# EasyEDA Pro project TC358870 HDMI2MIPI.epro, board PCB11
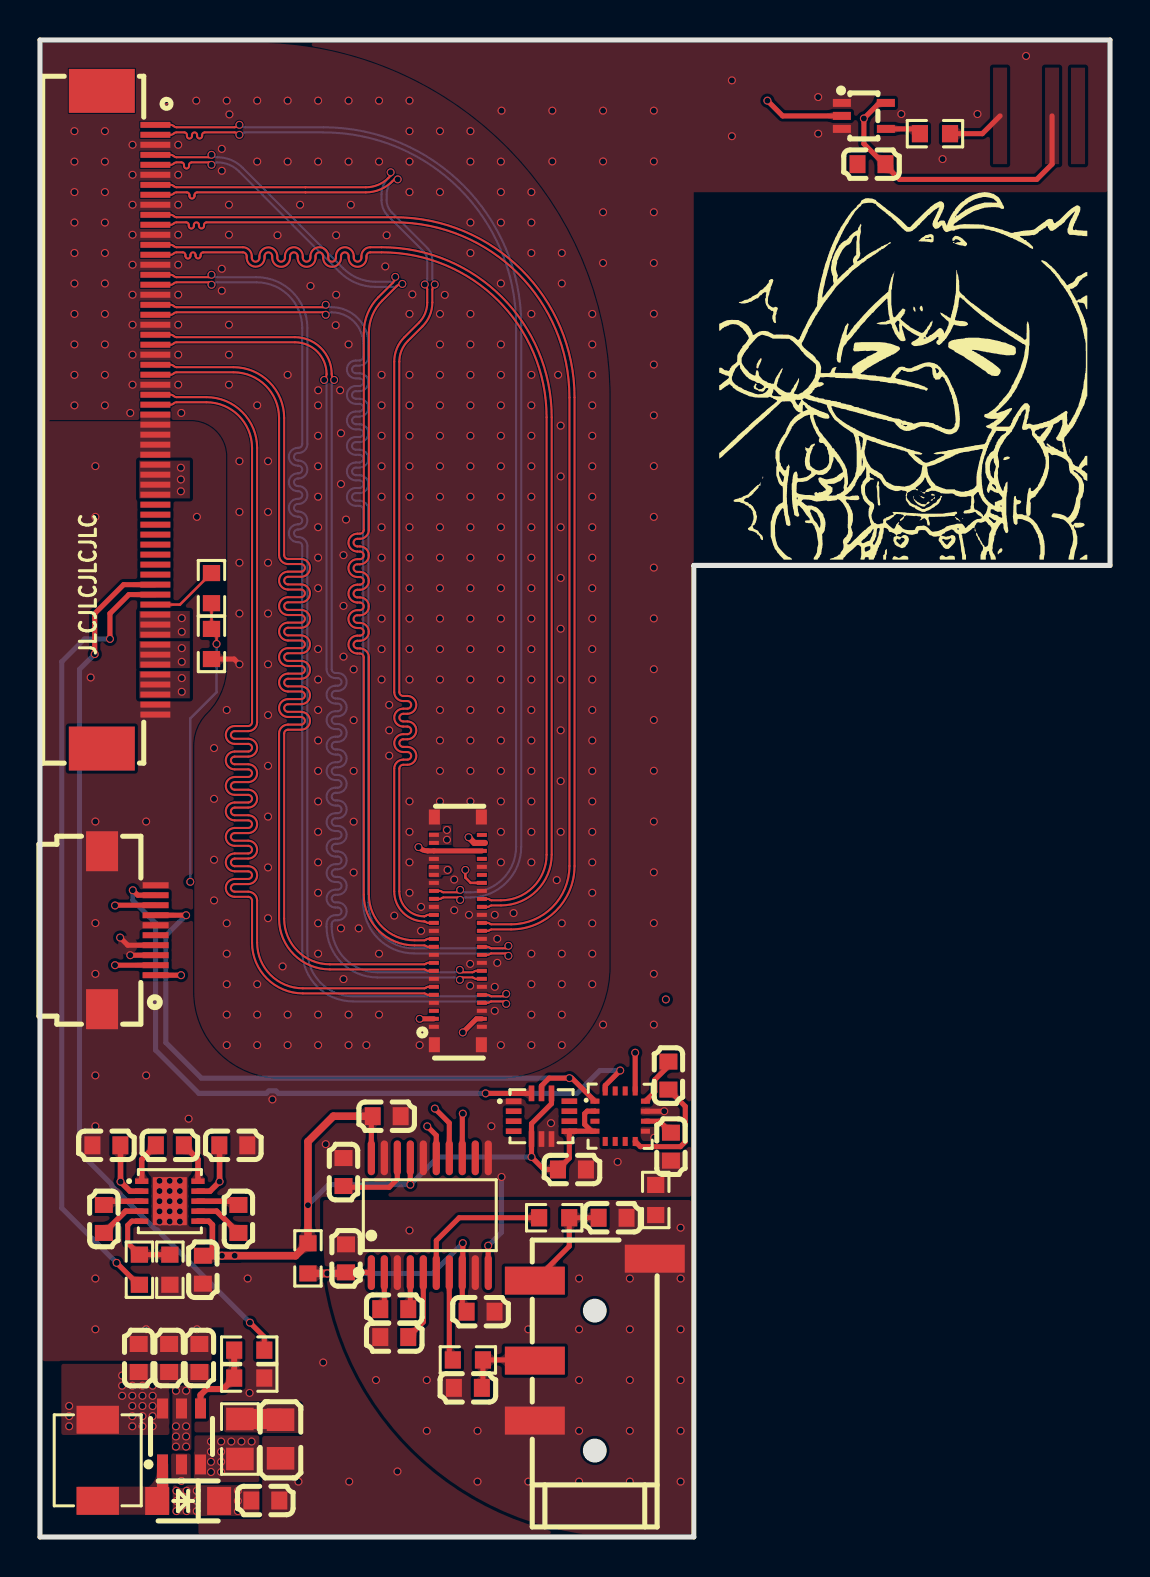
[diagram p12: board, top side]
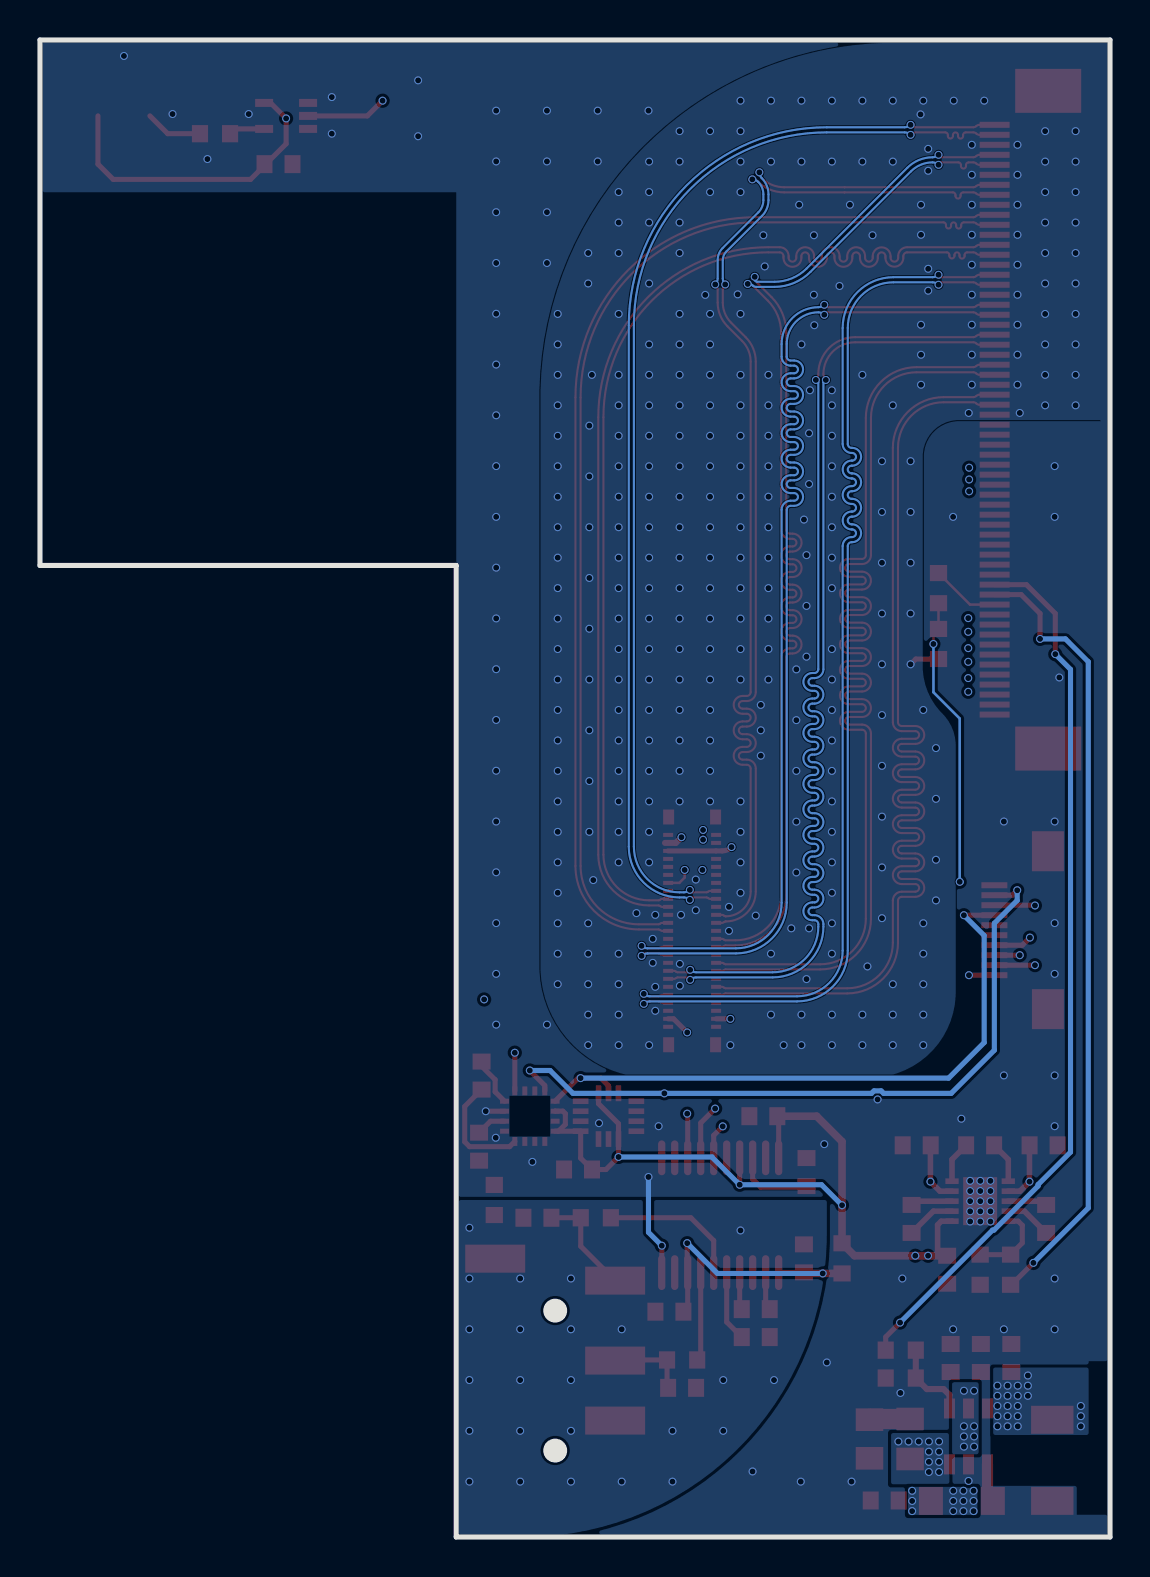
[diagram p13: board, bottom side, seen from below]

Outline 53.53 x 74.89 mm; copper layers: Top Layer, Inner1, Inner2, Bottom Layer. Coordinates in mm from the lower left corner of the outline.
Outline path: 0,74.89 0,0 32.71,0 32.71,48.6 53.53,48.6 53.53,74.89 0,74.89
Stack: Top Layer 0.035mm 外层铜厚1oz / Dielectric1 0.2104mm 7628 RC49% 8.6mil / Inner1 0.0152mm 内层铜厚 / Dielectric2 1.065mm 1.1mm H/HOZ Copper / Inner2 0.0152mm 内层铜厚 / Dielectric3 0.2104mm 7628 RC49% 8.6mil / Bottom Layer 0.035mm 外层铜厚1oz

## Design rules (mm)
net MIPI0_D0N: MIPI0_D0
net MIPI0_D0P: MIPI0_D0
net MIPI0_D1N: MIPI0_D1
net MIPI0_D1P: MIPI0_D1
net MIPI0_CN: MIPI0_C
net MIPI0_CP: MIPI0_C
net MIPI0_D2N: MIPI0_D2
net MIPI0_D2P: MIPI0_D2
net MIPI0_D3N: MIPI0_D3
net MIPI0_D3P: MIPI0_D3
net MIPI1_D0N: MIPI1_D0
net MIPI1_D0P: MIPI1_D0
net MIPI1_D1N: MIPI1_D1
net MIPI1_D1P: MIPI1_D1
net MIPI1_CN: MIPI1_C
net MIPI1_CP: MIPI1_C
net MIPI1_D2N: MIPI1_D2
net MIPI1_D2P: MIPI1_D2
net MIPI1_D3N: MIPI1_D3
net MIPI1_D3P: MIPI1_D3
template: 自定义配置
spacing copperThickness1oz (default): track to track 0.102, other pairs 0.102 to 0.3
spacing copperThickness2oz: track to track 0.203, other pairs 0.152 to 0.3
spacing copperThicknessInner0.5oz: track to track 0.089, other pairs 0.152 to 0.3
track width copperThickness1oz (default): min 0.102, default 0.254, max 2.54
track width copperThickness2oz: min 0.203, default 0.254, max 2.54
track width copperThickness0.5oz: min 0.089, default 0.254, max 2.54
differential pair differentialPair: width min 0.127, default 0.127, max 2.54; gap min 0.127, default 0.127
differential pair 5mil (default): width min 0.104, default 0.104, max 2.54; gap min 0.152, default 0.152
via viaSize (default): diameter min 0.399, default 0.399, max 10; hole min 0.3, default 0.3, max 6.299
net MIPI0_D0N uses diff
net MIPI0_D0P uses diff
net MIPI0_D1N uses diff
net MIPI0_D1P uses diff
net MIPI0_CN uses diff
net MIPI0_CP uses diff
net MIPI0_D2N uses diff
net MIPI0_D2P uses diff
net MIPI0_D3N uses diff
net MIPI0_D3P uses diff
net MIPI1_D0N uses diff
net MIPI1_D0P uses diff
net MIPI1_D1N uses diff
net MIPI1_D1P uses diff
net MIPI1_CN uses diff
net MIPI1_CP uses diff
net MIPI1_D2N uses diff
net MIPI1_D2P uses diff
net MIPI1_D3N uses diff
net MIPI1_D3P uses diff
eq len grp MIPI uses diff

## Placement (name value [footprint] x y rotation side)
C1  10uF  [C0603]  4.94 8.96 270 top
C2  10uF  [C0603]  6.46 8.96 270 top
C3  100nF  [C0603]  7.97 8.96 270 top
C4  2.2uF  [C0603]  11.27 1.83 180 top
C5  100nF  [C0603]  17.34 21.05 180 top
C6  100nF  [C0603]  15.31 13.94 270 top
C7  100nF  [C0603]  15.19 18.26 90 top
C8  2.2uF  [C0603]  17.72 11.4 0 top
C9  2.2nF  [C0603]  28.65 15.97 0 top
C10  2.2uF  [C0603]  17.72 10 180 top
C11  2.2nF  [C0603]  21.41 7.46 0 top
C12  100nF  [C0603]  22.04 11.27 0 top
C13  10uF  [C0603]  8.15 13.37 90 top
C14  2.2uF  [C0603]  3.2 15.91 90 top
C15  10uF  [C0603]  9.67 19.59 180 top
C16  2.2uF  [C0603]  9.93 15.91 90 top
C17  10uF  [C0603]  3.32 19.59 0 top
C18  2.2uF  [C0603]  6.5 19.59 180 top
C19  220nF  [C0603]  31.44 23.08 90 top
C20  4.7uF  [C0603]  31.57 19.53 270 top
C21  100nF  [C0603]  41.6 68.68 180 top
CN1  PJ-320D  [AUDIO-SMD_PJ-320D]  27.76 9.87 180 top
D1  SS36FA  [SOD-123FL_L2.8-W1.8-LS3.6-RD]  7.41 1.8 180 top
FPC1  AFC01-S60FCA-00  [FPC-SMD_AFC01-S60FCC-00]  4.43 55.89 270 top
FPC2  AFC01-S10FCA-00  [FPC-SMD_P0.5-10P_FGS-XJ-H2.0]  4.45 30.35 90 top
L1  4.7uH  [IND-SMD_L4.4-W4.2]  2.89 3.84 270 top
L2  CBG201209U121T  [L0805]  12.03 4.9 90 top
R1  10kΩ  [R0603]  8.58 47.47 270 top
R2  12kΩ  [R0603]  8.58 44.67 90 top
R3  5.9Ω  [R0805]  10 4.9 270 top
R4  0Ω  [R0603]  30.81 16.86 90 top
R5  10kΩ  [R0603]  10.47 9.35 180 top
R6  0Ω  [R0603]  13.41 13.94 90 top
R7  100kΩ  [R0603]  10.47 7.95 0 top
R8  470Ω  [R0603]  25.73 15.97 180 top
R9  470Ω  [R0603]  21.41 8.86 180 top
R10  10kΩ  [R0603]  4.97 13.37 90 top
R11  100kΩ  [R0603]  6.5 13.37 270 top
R12  470Ω  [R0603]  44.78 70.2 0 top
U1  RT9293BGJ6  [SOT-23-6_L2.9-W1.6-P0.95-LS2.8-BR]  7.08 5.03 270 top
U2  WP7B-S050VA1-R8000  [CONN-SMD_WP7B-S050VA1-R8000]  20.91 30.32 90 top
U3  PCM5102APWR  [TSSOP-20_L6.5-W4.4-P0.65-LS6.4-BL]  19.5 16.1 0 top
U4  LP3102QVF  [TDFN-10_L3.0-W3.0-P0.50-BL-EP]  6.5 16.8 270 top
U5  BMI160  [LGA-14_L3.0-W2.5-P0.50-BL]  25.09 21.05 270 top
U6  QMC5883L  [LGA-16_L3.0-W3.0-P0.50-BL_SQ]  29.03 21.05 270 top
U7  100nF  [C0603]  26.62 18.38 180 top
U9  SN74LV1T34DCKR  [SC-70-5_L2.1-W1.3-P0.65-LS2.1-BR]  41.22 71.09 180 top

## Footprints (pads in the part's own frame, mm; a bottom-side part is the same pattern mirrored in y, then rotated)
AUDIO-SMD_PJ-320D
  rect 3x1.4 smd: 1(-3,-4.05) 2(3,4.05) 3(3,1.05) 4(3,-2.95)
C0603
  rect 0.8x0.9 smd: 1(-0.7,0) 2(0.7,0)
CONN-SMD_WP7B-S050VA1-R8000
  rect 0.2x0.5 smd: 1(-4.8,1.2) 2(-4.8,-1.2) 3(-4.4,1.2) 4(-4.4,-1.2) 5(-4,1.2) 6(-4,-1.2) 7(-3.6,1.2) 8(-3.6,-1.2) 9(-3.2,1.2) 10(-3.2,-1.2) 11(-2.8,1.2) 12(-2.8,-1.2) 13(-2.4,1.2) 14(-2.4,-1.2) 15(-2,1.2) 16(-2,-1.2) 17(-1.6,1.2) 18(-1.6,-1.2) 19(-1.2,1.2) 20(-1.2,-1.2) 21(-0.8,1.2) 22(-0.8,-1.2) 23(-0.4,1.2) 24(-0.4,-1.2) 25(0,1.2) 26(0,-1.2) 27(0.4,1.2) 28(0.4,-1.2) 29(0.8,1.2) 30(0.8,-1.2) 31(1.2,1.2) 32(1.2,-1.2) 33(1.6,1.2) 34(1.6,-1.2) 35(2,1.2) 36(2,-1.2) 37(2.4,1.2) 38(2.4,-1.2) 39(2.8,1.2) 40(2.8,-1.2) 41(3.2,1.2) 42(3.2,-1.2) 43(3.6,1.2) 44(3.6,-1.2) 45(4,1.2) 46(4,-1.2) 47(4.4,1.2) 48(4.4,-1.2) 49(4.8,1.2) 50(4.8,-1.2)
  rect 0.75x0.55 smd: 51(-5.696,1.175) 52(5.696,1.175) 53(-5.696,-1.175) 54(5.696,-1.175)
FPC-SMD_AFC01-S60FCC-00
  rect 0.3x1.5 smd: 1(-14.75,1.34) 2(-14.251,1.34) 3(-13.751,1.34) 4(-13.25,1.34) 5(-12.75,1.34) 6(-12.249,1.34) 7(-11.749,1.34) 8(-11.25,1.34) 9(-10.751,1.34) 10(-10.251,1.34) 11(-9.75,1.34) 12(-9.249,1.34) 13(-8.749,1.34) 14(-8.25,1.34) 15(-7.75,1.34) 16(-7.25,1.34) 17(-6.75,1.34) 18(-6.25,1.34) 19(-5.75,1.34) 20(-5.249,1.34) 21(-4.749,1.34) 22(-4.251,1.34) 23(-3.751,1.34) 24(-3.25,1.34) 25(-2.75,1.34) 26(-2.249,1.34) 27(-1.749,1.34) 28(-1.25,1.34) 29(-0.751,1.34) 30(-0.251,1.34) 31(0.25,1.34) 32(0.75,1.34) 33(1.25,1.337) 34(1.751,1.337) 35(2.252,1.337) 36(2.749,1.34) 37(3.249,1.34) 38(3.75,1.34) 39(4.25,1.34) 40(4.751,1.34) 41(5.251,1.34) 42(5.749,1.34) 43(6.25,1.34) 44(6.75,1.34) 45(7.25,1.34) 46(7.75,1.34) 47(8.251,1.34) 48(8.75,1.34) 49(9.249,1.34) 50(9.749,1.34) 51(10.25,1.34) 52(10.751,1.34) 53(11.251,1.34) 54(11.751,1.34) 55(12.25,1.34) 56(12.749,1.34) 57(13.249,1.34) 58(13.75,1.34) 59(14.251,1.34) 60(14.751,1.34)
  rect 2.2x3.3 smd: 61(-16.45,-1.34) 62(16.45,-1.34)
FPC-SMD_P0.5-10P_FGS-XJ-H2.0
  rect 0.3x1.3 smd: 1(-2.25,-1.339) 2(-1.75,-1.339) 3(-1.25,-1.34) 4(-0.75,-1.339) 5(-0.25,-1.34) 6(0.25,-1.339) 7(0.75,-1.339) 8(1.25,-1.339) 9(1.75,-1.339) 10(2.25,-1.34)
  rect 2x1.6 smd: 11(3.95,1.34) 12(-3.95,1.34)
IND-SMD_L4.4-W4.2
  rect 1.4x2.12 smd: 1(2.028,0) 2(-2.028,0)
L0805
  rect 1.133x1.377 smd: 1(-0.967,0) 2(0.966,0)
LGA-14_L3.0-W2.5-P0.50-BL
  rect 0.28x0.785 smd: 1(-0.75,-1.393) 2(-0.25,-1.393) 3(0.25,-1.393) 4(0.75,-1.393) 8(0.75,1.393) 9(0.25,1.393) 10(-0.25,1.393) 11(-0.75,1.393)
  rect 0.785x0.28 smd: 5(1.143,-0.5) 6(1.143,0) 7(1.143,0.5) 12(-1.143,0.5) 13(-1.143,0) 14(-1.143,-0.5)
LGA-16_L3.0-W3.0-P0.50-BL_SQ
  rect 0.25x0.45 smd: 1(-0.75,-1.263) 2(-0.25,-1.263) 3(0.25,-1.263) 4(0.75,-1.263) 9(0.75,1.263) 10(0.25,1.263) 11(-0.25,1.263) 12(-0.75,1.263)
  rect 0.45x0.25 smd: 5(1.263,-0.75) 6(1.263,-0.25) 7(1.263,0.25) 8(1.263,0.75) 13(-1.263,0.75) 14(-1.263,0.25) 15(-1.263,-0.25) 16(-1.263,-0.75)
R0603
  rect 0.806x0.864 smd: 1(-0.753,0) 2(0.753,0)
R0805
  rect 1.133x1.377 smd: 1(-1,0) 2(1,0)
SC-70-5_L2.1-W1.3-P0.65-LS2.1-BR
  rect 0.9x0.4 smd: 1(1.1,-0.65) 2(1.1,0) 3(1.1,0.65) 4(-1.1,0.65) 5(-1.1,-0.65)
SOD-123FL_L2.8-W1.8-LS3.6-RD
  rect 1.2x1.4 smd: 1(-1.55,0) 2(1.55,0)
SOT-23-6_L2.9-W1.6-P0.95-LS2.8-BR
  rect 1x0.55 smd: 1(1.4,-0.95) 2(1.4,0) 3(1.4,0.95) 4(-1.4,0.95) 5(-1.4,0) 6(-1.4,-0.95)
TDFN-10_L3.0-W3.0-P0.50-BL-EP
  rect 0.28x0.665 smd: 1(-1,-1.407) 2(-0.5,-1.407) 3(0,-1.407) 4(0.5,-1.407) 5(1,-1.407) 6(1,1.407) 7(0.5,1.407) 8(0,1.407) 9(-0.5,1.407) 10(-1,1.407)
  rect 2.4x1.7 smd: 11(0,0)
TSSOP-20_L6.5-W4.4-P0.65-LS6.4-BL
  oval 0.364x1.742 smd: 1(-2.925,-2.871) 2(-2.275,-2.871) 3(-1.625,-2.871) 4(-0.975,-2.871) 5(-0.325,-2.871) 6(0.325,-2.871) 7(0.975,-2.871) 8(1.625,-2.871) 9(2.275,-2.871) 10(2.925,-2.871) 11(2.925,2.871) 12(2.275,2.871) 13(1.625,2.871) 14(0.975,2.871) 15(0.325,2.871) 16(-0.325,2.871) 17(-0.975,2.871) 18(-1.625,2.871) 19(-2.275,2.871) 20(-2.925,2.871)

## Nets
As in the schematic.

Pads without a net: C21 2; FPC1 61 62; R12 2; U2 5 40 44 50; U3 12; U5 2 3 4 9 10 11; U6 3 5 6 7 14 15

## Via types
v1: diameter 0.4, hole 0.3, Top Layer to Bottom Layer, 71 vias
v2: diameter 0.399, hole 0.299, Top Layer to Bottom Layer, 487 vias

## Routing (per net, layer and track width the routed paths; a pad name or vN(x,y) marks a point on that pad's centre or on a via; arc(x,y) is an arc through that point)
AGND:
  vias: v2(16.81,7.85) v2(18.49,15.34) v2(19.35,7.85) v2(19.35,5.31) v2(21.89,5.31) v2(21.89,2.77) v2(24.43,10.39) v2(24.43,2.77) v2(26.97,12.93) v2(26.97,10.39) v2(26.97,7.85) v2(26.97,5.31) v2(26.97,2.77) v2(29.51,12.93) v2(29.51,10.39) v2(29.51,7.85) v2(29.51,5.31) v2(29.51,2.77) v2(32.05,15.47) v2(32.05,12.93) v2(32.05,10.39) v2(32.05,7.85) v2(32.05,5.31) v2(32.05,2.77)
AVCC: length 14.1
  Top Layer w0.254: U3.1 16.57,13.24 C6.2 ; v2(21.15,14.7) 21.15,13.25 U3.8 21.13,11.36 21.22,11.27
  Top Layer w0.381: R6.1 v2(14.37,13.19) 15.26,13.19 C6.2
  Bottom Layer w0.254: v2(14.37,13.19) 19.64,13.19 v2(21.15,14.7)
AVDD_P+: length 19.6
  Top Layer w0.254: v2(21.15,25.24) 21.83,25.92 U2.4
  Top Layer w0.28: U4.9 8.51,17.3 v2(8.99,17.78) 8.99,19.58 C15.2
  Inner2 w0.508: v2(8.99,17.78) 13.69,17.78 v2(21.15,25.24)
AVDD_P-: length 22.1
  Top Layer w0.254: U2.3 v2(19,25.92)
  Top Layer w0.28: U4.2 4.51,17.3 v2(4.03,17.78) 4.03,19.59 C17.2
  Inner2 w0.508: v2(4.03,17.78) 6.41,20.16 13.24,20.16 v2(19,25.92)
GND: length 6
  Top Layer w0.254: U6.11 v2(31.23,21.3) ; 22.43,13.23 22.42,13.23 v2(22.42,14.57)
  Bottom Layer w0.254: v2(22.42,14.57) 23.09,15.24 v2(23.09,18.01)
  vias: v1(5.98,17.82) v1(5.98,17.31) v1(5.98,16.8) v1(5.98,16.29) v1(5.98,15.78) v1(6.49,17.82) v1(6.49,17.31) v1(6.49,16.8) v1(6.49,16.29) v1(6.49,15.78) v1(7,17.82) v1(7,17.31) v1(7,16.8) v1(7,16.29) v1(7,15.78) v1(7.08,2.8) v2(2.54,43) v2(2.77,53.57) v2(2.77,51.03) v2(2.77,35.79) v2(2.77,30.71) v2(2.77,28.17) v2(2.77,23.09) v2(2.77,20.55) v2(2.77,12.93) v2(2.77,10.39) v2(5.31,35.79) v2(5.31,23.09) v2(5.31,10.39) v2(7.44,20.92) v2(7.85,51.03) v2(7.85,10.39) v2(10.39,12.93) v2(10.49,7.21) v2(11.63,21.89) v2(12.93,2.77) v2(14.17,8.73) v2(14.3,19.65) v2(15.47,2.77) v2(17.88,3.28) v2(22.58,20.55) v2(23.09,71.35) v2(25.57,20.7) v2(25.63,71.35) v2(25.63,68.81) v2(28.17,71.35) v2(28.17,68.81) v2(28.17,66.27) v2(28.17,63.73) v2(28.17,25.63) v2(28.9,18.76) v2(30.71,71.35) v2(30.71,68.81) v2(30.71,66.27) v2(30.71,63.73) v2(30.71,61.19) v2(30.71,58.65) v2(30.71,56.11) v2(30.71,53.57) v2(30.71,51.03) v2(30.71,48.49) v2(30.71,45.95) v2(30.71,43.41) v2(30.71,40.87) v2(30.71,38.33) v2(30.71,35.79) v2(30.71,33.25) v2(30.71,30.71) v2(30.71,28.17) v2(30.71,25.63) v2(30.73,19.97) v2(34.62,72.87) v2(34.62,70.07) v2(38.93,72.03) v2(38.93,70.2) v2(43.09,71.18) v2(45.16,68.93) v2(46.9,71.18) v2(49.33,74.09)
GND_P: length 1.5
  Top Layer w0.254: v2(9.98,43.66) 9.72,43.92 R2.1
  vias: v2(1.72,70.33) v2(1.72,68.8) v2(1.72,67.28) v2(1.72,65.75) v2(1.72,64.23) v2(1.72,62.71) v2(1.72,61.18) v2(1.72,59.66) v2(1.72,58.13) v2(1.72,56.61) v2(3.25,70.33) v2(3.25,68.8) v2(3.25,67.28) v2(3.25,65.75) v2(3.25,64.23) v2(3.25,62.71) v2(3.25,61.18) v2(3.25,59.66) v2(3.25,58.13) v2(3.25,56.61) v2(4.52,56.23) v2(4.63,69.64) v2(4.63,68.14) v2(4.63,66.64) v2(4.63,65.14) v2(4.63,63.64) v2(4.63,62.14) v2(4.63,60.64) v2(4.63,59.14) v2(4.63,57.64) v2(6.29,71.85) v2(6.92,69.64) v2(6.92,68.14) v2(6.92,66.64) v2(6.92,65.14) v2(6.92,63.64) v2(6.92,62.14) v2(6.92,60.64) v2(6.92,59.14) v2(6.92,57.64) v2(7.07,56.23) v2(7.82,71.85) v2(8.71,39.47) v2(8.71,36.93) v2(8.71,33.88) v2(8.71,31.85) v2(9.1,69.44) v2(9.1,68.34) v2(9.1,63.44) v2(9.1,62.34) v2(9.34,71.85) v2(9.34,41.37) v2(9.34,30.7) v2(9.34,29.18) v2(9.34,27.65) v2(9.34,26.13) v2(9.34,24.61) v2(9.48,71.16) v2(9.46,66.64) v2(9.46,65.14) v2(9.46,60.64) v2(9.46,59.14) v2(9.46,57.64) v2(9.98,53.82) v2(9.98,51.28) v2(9.98,48.74) v2(9.98,46.2) v2(10.87,71.85) v2(10.87,68.8) v2(10.87,56.61) v2(10.87,27.65) v2(10.87,26.13) v2(10.87,24.61) v2(11.41,53.82) v2(11.41,51.28) v2(11.41,48.74) v2(11.41,46.2) v2(11.41,43.66) v2(11.41,41.12) v2(11.41,38.58) v2(11.41,36.04) v2(11.41,33.5) v2(11.41,30.96) v2(11.88,65.12) v2(12.14,28.54) v2(12.39,71.85) v2(12.39,68.8) v2(12.39,58.13) v2(12.39,26.13) v2(12.39,24.61) v2(13.01,66.64) v2(13.53,62.58) v2(13.91,71.85) v2(13.91,68.8) v2(13.92,57.36) v2(13.91,56.61) v2(13.91,55.09) v2(13.91,53.56) v2(13.91,52.04) v2(13.91,50.51) v2(13.91,48.99) v2(13.91,47.47) v2(13.91,44.42) v2(13.91,42.89) v2(13.91,41.37) v2(13.91,39.85) v2(13.91,38.32) v2(13.91,36.8) v2(13.91,35.27) v2(13.91,33.75) v2(13.91,32.23) v2(13.91,30.7) v2(13.91,29.18) v2(13.91,26.13) v2(13.91,24.61) v2(14.81,65.12) v2(14.82,62.14) v2(14.8,60.62) v2(15.01,57.36) v2(15.06,55.21) v2(15.06,52.67) v2(15.06,30.45) v2(15.19,49.12) v2(15.19,46.58) v2(15.19,44.04) v2(15.19,27.91) v2(15.31,50.9) v2(15.44,71.85) v2(15.44,68.8) v2(15.44,59.66) v2(15.44,26.13) v2(15.44,24.61) v2(15.55,66.64) v2(15.69,43.4) v2(15.69,40.86) v2(15.69,38.32) v2(15.69,35.78) v2(15.69,33.24) v2(15.95,30.45) v2(16.33,24.61) v2(16.96,71.85) v2(16.96,68.8) v2(16.96,29.18) v2(16.96,26.13) v2(17.09,58.13) v2(17.09,56.61) v2(17.09,55.09) v2(17.09,53.56) v2(17.09,52.04) v2(17.09,50.51) v2(17.09,48.99) v2(17.09,47.47) v2(17.09,45.94) v2(17.09,44.42) v2(17.09,42.89) v2(17.28,63.56) v2(17.34,65.12) v2(17.47,41.62) v2(17.47,40.35) v2(17.47,39.08) v2(17.72,31.08) v2(18.49,71.85) v2(18.49,70.33) v2(18.49,68.8) v2(18.49,67.28) v2(18.49,61.18) v2(18.49,58.13) v2(18.49,56.61) v2(18.49,55.09) v2(18.49,53.56) v2(18.49,52.04) v2(18.49,50.51) v2(18.49,48.99) v2(18.49,47.47) v2(18.49,45.94) v2(18.49,44.42) v2(18.49,42.89) v2(18.49,36.8) v2(18.49,35.27) v2(18.49,33.75) v2(18.49,32.23) v2(18.63,62.16) v2(19.06,31.52) v2(19.06,30.32) v2(19,24.61) v2(20.01,70.33) v2(20.01,67.28) v2(20.01,61.18) v2(20.01,59.66) v2(20.01,58.13) v2(20.01,56.61) v2(20.01,55.09) v2(20.01,53.56) v2(20.01,52.04) v2(20.01,50.51) v2(20.01,48.99) v2(20.01,47.47) v2(20.01,45.94) v2(20.01,44.42) v2(20.01,42.89) v2(20.01,41.37) v2(20.01,39.85) v2(20.01,38.32) v2(20.01,36.8) v2(20.25,62.14) v2(20.72,32.89) v2(20.72,31.36) v2(21.46,31.12) v2(21.53,70.33) v2(21.53,68.8) v2(21.53,65.75) v2(21.53,64.23) v2(21.53,61.18) v2(21.53,59.66) v2(21.53,58.13) v2(21.53,56.61) v2(21.53,55.09) v2(21.53,53.56) v2(21.53,52.04) v2(21.53,50.51) v2(21.53,48.99) v2(21.53,47.47) v2(21.53,45.94) v2(21.53,44.42) v2(21.53,42.89) v2(21.53,41.37) v2(21.53,39.85) v2(21.53,38.32) v2(21.53,36.8) v2(21.52,28.67) v2(21.52,27.57) v2(22.75,31.12) v2(22.75,27.52) v2(22.75,26.32) v2(22.88,29.92) v2(22.88,28.72) v2(23.06,68.8) v2(23.06,67.28) v2(23.06,65.75) v2(23.06,62.71) v2(23.06,59.66) v2(23.06,58.13) v2(23.06,56.61) v2(23.06,55.09) v2(23.06,53.56) v2(23.06,52.04) v2(23.06,50.51) v2(23.06,48.99) v2(23.06,47.47) v2(23.06,45.94) v2(23.06,44.42) v2(23.06,42.89) v2(23.06,41.37) v2(23.06,39.85) v2(23.06,38.32) v2(23.06,36.8) v2(23.06,35.27) v2(23.06,33.75) v2(23.06,24.61) v2(23.69,31.21) v2(24.58,67.28) v2(24.58,65.75) v2(24.58,64.23) v2(24.58,61.18) v2(24.58,58.13) v2(24.58,56.61) v2(24.58,55.09) v2(24.58,53.56) v2(24.58,52.04) v2(24.58,50.51) v2(24.58,48.99) v2(24.58,47.47) v2(24.58,45.94) v2(24.58,44.42) v2(24.58,42.89) v2(24.58,41.37) v2(24.58,39.85) v2(24.58,38.32) v2(24.58,36.8) v2(24.58,35.27) v2(24.58,33.75) v2(24.58,29.18) v2(24.58,27.65) v2(24.58,26.13) v2(24.58,24.61) v2(25.85,32.86) v2(25.92,58.13) v2(26.05,55.59) v2(26.05,53.05) v2(26.05,50.51) v2(26.05,47.97) v2(26.05,45.43) v2(26.05,42.89) v2(26.05,40.35) v2(26.05,37.81) v2(26.05,35.27) v2(26.11,64.23) v2(26.11,62.71) v2(26.11,30.7) v2(26.11,29.18) v2(26.11,27.65) v2(26.11,26.13) v2(26.11,24.61) v2(27.63,61.18) v2(27.63,59.66) v2(27.63,58.13) v2(27.63,56.61) v2(27.63,55.09) v2(27.63,53.56) v2(27.63,52.04) v2(27.63,50.51) v2(27.63,48.99) v2(27.63,47.47) v2(27.63,45.94) v2(27.63,44.42) v2(27.63,42.89) v2(27.63,41.37) v2(27.63,39.85) v2(27.63,38.32) v2(27.63,36.8) v2(27.63,35.27) v2(27.63,33.75) v2(27.63,32.23) v2(27.63,30.7) v2(27.63,29.18) v2(27.63,27.65)
V1.1:
  vias: v2(7.09,42.97) v2(7.09,42.28)
V1.8_P: length 26.6
  Top Layer w0.254: U2.46 U2.45 19.4,34.32 arc(19.15,34.37) v2(18.94,34.51)
  Inner1 w0.508: v2(18.94,34.51) 9.72,34.51 5.53,38.7 5.53,43.15 6.16,43.78 v2(7.09,43.78)
  Inner2 w0.508: v2(20.39,33.37) 19.25,34.51 v2(18.94,34.51)
  vias: v2(7.09,44.46)
V3.3: length 97
  Top Layer w0.254: 27.59,20.3 U6.4 ; 27.59,20.3 U5.8 26.48,18.95 U7.2 25.22,18.38 v2(24.59,19.01) U5.5 24.59,20.68 25.59,21.68 U5.12 ; 27.59,20.3 27.25,20.64 27.25,21.18 27.38,21.3 27.76,21.3 U6.2 ; U6.13 v2(29.78,24.23) ; 16.58,18.97 16.58,20.98 C5.2 ; 18.53,18.97 v2(18.53,17.62) ; FPC2.1 v2(7.06,28.1)
  Top Layer w0.28: U4.6 7.91,15.8 8.44,15.8 8.63,15.62 8.63,14.13 8.56,14.07
  Top Layer w0.381: 8.15,14.07 v1(9.1,14.07) v1(9.74,14.07) 12.79,14.07 R6.2 v2(13.41,16.6) 13.41,19.78 14.68,21.05 C5.2
  Inner1 w0.254: v2(24.59,19.01) 27.38,21.8 27.38,22.96 28.65,24.23 v2(29.78,24.23)
  Inner2 w0.762: 7.06,45.56 6.04,45.56 3.5,43.02 3.5,35.91 6.42,32.99 6.42,28.74 v2(7.06,28.1) 7.06,22.19 2.99,18.13 2.99,15.52 4.52,14 4.52,13.94 5.02,13.44 8.47,13.44 v1(9.1,14.07) v1(9.74,14.07)
  Bottom Layer w0.254: v2(24.59,19.01) 19.92,19.01 v2(18.53,17.62) 14.43,17.62 v2(13.41,16.6)
  vias: v2(7.09,45.97) v2(7.09,45.28)
V5: length 129.9
  Top Layer w0.254: 50.63,71.09 50.63,68.68 49.87,67.91 43,67.91 41.22,69.69 v2(41.22,70.96) 42,71.74 U9.5
  Inner1 w0.254: v2(41.22,70.96) 35.63,70.96 32.71,73.88 1.72,73.88 0.96,73.12 0.96,54.32 2.97,52.31 v2(7.05,52.31)
  Inner2 w0.762: 1.47,7.84 1.47,46.73 v2(7.05,52.31)
  vias: v1(1.46,6.55) v1(1.46,6.05) v1(1.46,5.54) v1(4.11,8.08) v1(4.11,7.57) v1(4.11,7.06) v1(4.62,7.57) v1(4.62,7.06) v1(4.62,6.55) v1(4.62,6.05) v1(4.62,5.54) v1(5.13,7.57) v1(5.13,7.06) v1(5.13,6.55) v1(5.13,6.05) v1(5.13,5.54) v1(5.63,7.57) v1(5.63,7.06) v1(5.63,6.55) v1(5.63,6.05) v1(5.63,5.54) v2(7.05,53.49) v2(7.05,52.9)
(no net): length 2.9
  Top Layer w0.254: R12.2 47.14,70.2 48.03,71.09
C1N: length 2.3
  Top Layer w0.28: C14.1 4.28,16.3 U4.4
C1P: length 2
  Top Layer w0.28: C14.2 3.38,16.8 U4.3
C2N: length 2.5
  Top Layer w0.28: U4.7 8.84,16.3 C16.1
C2P: length 2.1
  Top Layer w0.28: C16.2 9.74,16.8 U4.8
C3N: length 2.1
  Top Layer w0.28: 7.2,19.59 7.91,18.89 U4.10
C3P: length 2.1
  Top Layer w0.28: U4.1 5.09,18.89 C18.2
EN_AVDD_P: length 39.6
  Top Layer w0.254: FPC1.48 4.45,47.14 3.5,46.2 v2(3.5,44.93) ; R10.1 4.93,12.62 v1(3.83,13.71)
  Bottom Layer w0.254: v1(3.83,13.71) 1.09,16.46 1.09,43.78 2.23,44.93 v2(3.5,44.93)
EN_LED_P: length 44.7
  Top Layer w0.254: v2(2.74,44.16) 2.74,46.2 4.18,47.64 FPC1.47 ; v2(10.5,10.72) 11.22,10.01 R5.1
  Bottom Layer w0.254: v2(10.5,10.72) 5.87,15.35 5.8,15.35 3.6,17.56 3.6,17.63 1.98,19.25 1.98,43.4 v2(2.74,44.16)
EN_LP: length 4
  Top Layer w0.254: U4.5 4.59,15.8 4.39,15.59 4.39,14.71 R10.2 R11.1
EN_RT: length 4.1
  Top Layer w0.305: R5.2 R7.1 9.17,7.4 8.33,7.4 8.03,7.11 U1.4
I2S_SCK: length 26.6
  Top Layer w0.254: 21.13,18.97 21.13,21.15 v2(21.15,21.18) ; v2(4.01,29.99) 4.39,29.6 FPC2.4
  Inner1 w0.254: v2(4.01,29.99) 4.85,29.99 5.28,29.56 5.28,26.77 9.72,22.32 20.01,22.32 v2(21.15,21.18)
I2S_SD0: length 24
  Top Layer w0.254: v2(19.76,21.43) 20.48,20.71 20.48,18.97 ; FPC2.3 v2(4.52,29.1)
  Inner1 w0.254: v2(4.52,29.1) 4.52,26.38 9.47,21.43 v2(19.76,21.43)
I2S_WFS: length 24.3
  Top Layer w0.254: 19.83,18.97 19.83,20.09 v2(19.38,20.54) ; FPC2.2 v2(3.75,28.6)
  Inner1 w0.254: v2(19.38,20.54) 9.22,20.54 3.75,26 v2(3.75,28.6)
IIC_SCL: length 32.9
  Top Layer w0.254: U5.13 25.09,22.57 25.47,22.96 v2(26.49,22.96) 26.61,22.96 U6.1 ; FPC2.7 v2(7.31,31.1)
  Bottom Layer w0.254: v2(26.49,22.96) 8.07,22.96 6.29,24.73 6.29,30.09 v2(7.31,31.1)
IIC_SDA: length 38.1
  Top Layer w0.254: v2(29.03,23.34) 28.28,22.59 U6.16 ; U5.14 v2(22.3,22.19) ; v2(4.64,32.35) 4.89,32.1 FPC2.9
  Bottom Layer w0.254: v2(29.03,23.34) 28.01,23.34 26.87,22.19 v2(22.3,22.19) 11.93,22.19 11.81,22.32 11.45,22.32 11.33,22.19 7.95,22.19 5.79,24.35 5.79,30.7 4.64,31.85 v2(4.64,32.35)
IO1: length 3.5
  Top Layer w0.127: FPC1.49 7,46.64 R1.1
LX_LED_P: length 1.9
  Top Layer w0.559: 6.13,3.63 6.13,2.02 5.91,1.8
MIPI0_CN: length 56
  Top Layer w0.104: U2.14 21.8,27.92 arc(21.76,27.93) 21.72,27.96 arc(21.68,27.98) 21.63,27.99 21.13,27.99 v2(21.01,27.87) ; FPC1.23 6.54,59.64 arc(6.62,59.66) 6.69,59.7 arc(6.76,59.75) 6.84,59.76 12.75,59.76 arc(13.87,59.3) 14.34,58.18 arc(14.31,58.02) v2(14.22,57.88)
  Bottom Layer w0.104: v2(14.22,57.88) 14.33,57.76 arc(14.34,57.76) 14.34,57.75 14.34,43.41 arc(14.47,43.1) 14.79,42.97 14.9,42.97 arc(15.09,42.77) 14.9,42.58 14.79,42.58 arc(14.34,42.14) 14.79,41.69 14.9,41.69 arc(15.09,41.5) 14.9,41.31 14.79,41.31 arc(14.34,40.86) 14.79,40.42 14.9,40.42 arc(15.09,40.22) 14.9,40.03 14.79,40.03 arc(14.34,39.59) 14.79,39.14 14.9,39.14 arc(15.09,38.95) 14.9,38.76 14.79,38.76 arc(14.34,38.31) 14.79,37.86 14.9,37.86 arc(15.09,37.67) 14.9,37.48 14.79,37.48 arc(14.34,37.04) 14.79,36.59 14.9,36.59 arc(15.09,36.4) 14.9,36.21 14.79,36.21 arc(14.34,35.76) 14.79,35.31 14.9,35.31 arc(15.09,35.12) 14.9,34.93 14.79,34.93 arc(14.34,34.49) 14.79,34.04 14.9,34.04 arc(15.09,33.85) 14.9,33.66 14.79,33.66 arc(14.34,33.21) 14.79,32.76 14.9,32.76 arc(15.09,32.57) 14.9,32.38 14.79,32.38 arc(14.34,31.94) 14.79,31.49 14.9,31.49 arc(15.09,31.3) 14.9,31.11 14.79,31.11 arc(14.47,30.98) 14.34,30.66 14.34,30.53 arc(15.08,28.74) 16.88,27.99 20.71,27.99 arc(20.87,27.96) v2(21.01,27.87)
MIPI0_CP: length 56
  Top Layer w0.104: v2(21.01,28.37) 21.13,28.25 21.63,28.25 arc(21.68,28.26) 21.72,28.29 arc(21.76,28.31) 21.8,28.32 U2.16 ; FPC1.22 6.54,60.14 arc(6.62,60.13) 6.69,60.08 arc(6.76,60.04) 6.84,60.02 12.75,60.02 arc(14.05,59.48) 14.59,58.18 arc(14.63,58.02) v2(14.72,57.88)
  Bottom Layer w0.104: v2(14.72,57.88) 14.6,57.76 arc(14.6,57.76) 14.59,57.75 14.59,43.41 arc(14.65,43.28) 14.79,43.22 14.9,43.22 arc(15.34,42.77) 14.9,42.33 14.79,42.33 arc(14.59,42.14) 14.79,41.95 14.9,41.95 arc(15.34,41.5) 14.9,41.05 14.79,41.05 arc(14.59,40.86) 14.79,40.67 14.9,40.67 arc(15.34,40.22) 14.9,39.78 14.79,39.78 arc(14.59,39.59) 14.79,39.4 14.9,39.4 arc(15.34,38.95) 14.9,38.5 14.79,38.5 arc(14.59,38.31) 14.79,38.12 14.9,38.12 arc(15.34,37.67) 14.9,37.23 14.79,37.23 arc(14.59,37.04) 14.79,36.85 14.9,36.85 arc(15.34,36.4) 14.9,35.95 14.79,35.95 arc(14.59,35.76) 14.79,35.57 14.9,35.57 arc(15.34,35.12) 14.9,34.68 14.79,34.68 arc(14.59,34.49) 14.79,34.3 14.9,34.3 arc(15.34,33.85) 14.9,33.4 14.79,33.4 arc(14.59,33.21) 14.79,33.02 14.9,33.02 arc(15.34,32.57) 14.9,32.13 14.79,32.13 arc(14.59,31.94) 14.79,31.75 14.9,31.75 arc(15.34,31.3) 14.9,30.85 14.79,30.85 arc(14.65,30.8) 14.59,30.66 14.59,30.53 arc(15.26,28.92) 16.88,28.25 20.71,28.25 arc(20.87,28.28) v2(21.01,28.37)
MIPI0_D0N: length 56.1
  Top Layer w0.104: FPC1.29 6.54,56.64 arc(6.62,56.66) 6.69,56.7 arc(6.76,56.75) 6.83,56.76 8.33,56.76 arc(9.94,56.1) 10.61,54.48 10.61,40.76 arc(10.55,40.62) 10.42,40.57 9.74,40.57 arc(9.29,40.12) 9.74,39.68 10.42,39.68 arc(10.61,39.48) 10.42,39.29 9.74,39.29 arc(9.29,38.85) 9.74,38.4 10.42,38.4 arc(10.61,38.21) 10.42,38.02 9.74,38.02 arc(9.29,37.57) 9.74,37.13 10.42,37.13 arc(10.61,36.93) 10.42,36.74 9.74,36.74 arc(9.29,36.3) 9.74,35.85 10.42,35.85 arc(10.61,35.66) 10.42,35.47 9.74,35.47 arc(9.29,35.02) 9.74,34.58 10.42,34.58 arc(10.61,34.38) 10.42,34.19 9.74,34.19 arc(9.29,33.75) 9.74,33.3 10.42,33.3 arc(10.61,33.11) 10.42,32.92 9.74,32.92 arc(9.29,32.47) 9.74,32.02 10.42,32.02 arc(10.55,31.97) 10.61,31.83 10.61,29.73 arc(11.35,27.94) 13.15,27.19 19.23,27.19 arc(19.28,27.18) 19.32,27.16 arc(19.36,27.13) 19.4,27.12 U2.9
MIPI0_D0P: length 56.1
  Top Layer w0.104: U2.11 19.4,27.52 arc(19.36,27.51) 19.32,27.49 arc(19.28,27.46) 19.23,27.45 13.15,27.45 arc(11.53,28.12) 10.87,29.73 10.87,31.83 arc(10.73,32.15) 10.42,32.28 9.74,32.28 arc(9.55,32.47) 9.74,32.66 10.42,32.66 arc(10.87,33.11) 10.42,33.56 9.74,33.56 arc(9.55,33.75) 9.74,33.94 10.42,33.94 arc(10.87,34.38) 10.42,34.83 9.74,34.83 arc(9.55,35.02) 9.74,35.21 10.42,35.21 arc(10.87,35.66) 10.42,36.11 9.74,36.11 arc(9.55,36.3) 9.74,36.49 10.42,36.49 arc(10.87,36.93) 10.42,37.38 9.74,37.38 arc(9.55,37.57) 9.74,37.76 10.42,37.76 arc(10.87,38.21) 10.42,38.66 9.74,38.66 arc(9.55,38.85) 9.74,39.04 10.42,39.04 arc(10.87,39.48) 10.42,39.93 9.74,39.93 arc(9.55,40.12) 9.74,40.31 10.42,40.31 arc(10.73,40.44) 10.87,40.76 10.87,54.48 arc(10.12,56.28) 8.33,57.02 6.83,57.02 arc(6.76,57.04) 6.69,57.08 arc(6.62,57.13) 6.54,57.14 FPC1.28
MIPI0_D1N: length 56.1
  Top Layer w0.104: FPC1.26 6.54,58.14 arc(6.62,58.16) 6.69,58.2 arc(6.76,58.25) 6.84,58.26 9.68,58.26 arc(11.29,57.59) 11.96,55.98 11.96,49.12 arc(12.09,48.8) 12.41,48.67 13.06,48.67 arc(13.25,48.48) 13.06,48.29 12.41,48.29 arc(11.96,47.84) 12.41,47.4 13.06,47.4 arc(13.25,47.21) 13.06,47.02 12.41,47.02 arc(11.96,46.57) 12.41,46.12 13.06,46.12 arc(13.25,45.93) 13.06,45.74 12.41,45.74 arc(11.96,45.29) 12.41,44.85 13.06,44.85 arc(13.25,44.66) 13.06,44.47 12.41,44.47 arc(11.96,44.02) 12.41,43.57 13.06,43.57 arc(13.25,43.38) 13.06,43.19 12.41,43.19 arc(11.96,42.74) 12.41,42.3 13.06,42.3 arc(13.25,42.11) 13.06,41.91 12.41,41.91 arc(11.96,41.47) 12.41,41.02 13.06,41.02 arc(13.25,40.83) 13.06,40.64 12.41,40.64 arc(12.09,40.51) 11.96,40.19 11.96,30.93 arc(12.7,29.14) 14.5,28.39 19.23,28.39 arc(19.28,28.38) 19.32,28.36 arc(19.36,28.33) 19.4,28.32 U2.15
MIPI0_D1P: length 56.1
  Top Layer w0.104: FPC1.25 6.54,58.64 arc(6.62,58.63) 6.69,58.58 arc(6.76,58.54) 6.84,58.52 9.68,58.52 arc(11.47,57.78) 12.22,55.98 12.22,49.12 arc(12.27,48.98) 12.41,48.93 13.06,48.93 arc(13.51,48.48) 13.06,48.03 12.41,48.03 arc(12.22,47.84) 12.41,47.65 13.06,47.65 arc(13.51,47.21) 13.06,46.76 12.41,46.76 arc(12.22,46.57) 12.41,46.38 13.06,46.38 arc(13.51,45.93) 13.06,45.48 12.41,45.48 arc(12.22,45.29) 12.41,45.1 13.06,45.1 arc(13.51,44.66) 13.06,44.21 12.41,44.21 arc(12.22,44.02) 12.41,43.83 13.06,43.83 arc(13.51,43.38) 13.06,42.93 12.41,42.93 arc(12.22,42.74) 12.41,42.55 13.06,42.55 arc(13.51,42.11) 13.06,41.66 12.41,41.66 arc(12.22,41.47) 12.41,41.28 13.06,41.28 arc(13.51,40.83) 13.06,40.38 12.41,40.38 arc(12.27,40.33) 12.22,40.19 12.22,30.93 arc(12.89,29.32) 14.5,28.65 19.23,28.65 arc(19.28,28.66) 19.32,28.69 arc(19.36,28.71) 19.4,28.72 U2.17
MIPI0_D2N: length 56
  Top Layer w0.104: v2(23.44,29.07) 23.31,29.19 22.58,29.19 arc(22.54,29.18) 22.5,29.16 arc(22.46,29.13) 22.41,29.12 U2.20 ; FPC1.20 6.54,61.14 arc(6.62,61.16) 6.69,61.2 arc(6.76,61.25) 6.84,61.26 14.17,61.26 arc(14.17,61.26) 14.18,61.26 v2(14.3,61.14)
  Bottom Layer w0.104: v2(14.3,61.14) arc(14.43,61.23) 14.59,61.26 arc(15.71,60.8) 16.17,59.68 16.17,59.04 arc(16.12,58.91) 15.98,58.85 15.8,58.85 arc(15.36,58.41) 15.8,57.96 15.98,57.96 arc(16.17,57.77) 15.98,57.58 15.8,57.58 arc(15.36,57.13) 15.8,56.68 15.98,56.68 arc(16.17,56.49) 15.98,56.3 15.8,56.3 arc(15.36,55.86) 15.8,55.41 15.98,55.41 arc(16.17,55.22) 15.98,55.03 15.8,55.03 arc(15.36,54.58) 15.8,54.13 15.98,54.13 arc(16.17,53.94) 15.98,53.75 15.8,53.75 arc(15.35,53.3) 15.8,52.86 15.98,52.86 arc(16.17,52.67) 15.98,52.48 15.8,52.48 arc(15.36,52.03) 15.8,51.58 15.98,51.58 arc(16.12,51.53) 16.17,51.39 16.17,31.73 arc(16.92,29.94) 18.71,29.19 23.14,29.19 arc(23.3,29.16) v2(23.44,29.07)
MIPI0_D2P: length 56
  Top Layer w0.104: U2.22 22.41,29.52 arc(22.46,29.51) 22.5,29.49 arc(22.54,29.46) 22.58,29.45 23.31,29.45 v2(23.44,29.57) ; v2(14.3,61.64) 14.18,61.52 arc(14.17,61.52) 14.17,61.52 6.84,61.52 arc(6.76,61.54) 6.69,61.58 arc(6.62,61.63) 6.54,61.64 FPC1.19
  Bottom Layer w0.104: v2(23.44,29.57) arc(23.3,29.48) 23.14,29.45 18.71,29.45 arc(17.1,30.12) 16.43,31.73 16.43,51.39 arc(16.3,51.71) 15.98,51.84 15.8,51.84 arc(15.61,52.03) 15.8,52.22 15.98,52.22 arc(16.43,52.67) 15.98,53.11 15.8,53.11 arc(15.61,53.3) 15.8,53.5 15.98,53.5 arc(16.43,53.94) 15.98,54.39 15.8,54.39 arc(15.61,54.58) 15.8,54.77 15.98,54.77 arc(16.43,55.22) 15.98,55.66 15.8,55.66 arc(15.61,55.86) 15.8,56.05 15.98,56.05 arc(16.43,56.49) 15.98,56.94 15.8,56.94 arc(15.61,57.13) 15.8,57.32 15.98,57.32 arc(16.43,57.77) 15.98,58.21 15.8,58.21 arc(15.61,58.41) 15.8,58.6 15.98,58.6 arc(16.3,58.73) 16.43,59.04 16.43,59.68 arc(15.89,60.98) 14.59,61.52 arc(14.43,61.55) v2(14.3,61.64)
MIPI0_D3N: length 56
  Top Layer w0.104: v2(23.32,26.67) 23.2,26.79 22.58,26.79 arc(22.54,26.78) 22.5,26.76 arc(22.46,26.73) 22.41,26.72 U2.8 ; 5.77,62.64 6.54,62.64 arc(6.62,62.66) 6.69,62.7 arc(6.76,62.75) 6.84,62.76 8.45,62.76 arc(8.46,62.76) 8.46,62.76 v2(8.58,62.64)
  Bottom Layer w0.104: v2(23.32,26.67) arc(23.19,26.76) 23.03,26.79 15.66,26.79 arc(13.86,27.54) 13.12,29.33 13.12,49.57 arc(13.06,49.71) 12.93,49.76 12.9,49.76 arc(12.45,50.21) 12.9,50.66 12.93,50.66 arc(13.12,50.85) 12.93,51.04 12.9,51.04 arc(12.45,51.49) 12.9,51.93 12.93,51.93 arc(13.12,52.12) 12.93,52.31 12.9,52.31 arc(12.45,52.76) 12.9,53.21 12.93,53.21 arc(13.12,53.4) 12.93,53.59 12.9,53.59 arc(12.45,54.04) 12.9,54.48 12.93,54.48 arc(13.06,54.54) 13.12,54.67 13.12,60.48 arc(12.45,62.1) 10.84,62.76 8.88,62.76 arc(8.72,62.73) v2(8.58,62.64)
MIPI0_D3P: length 56
  Top Layer w0.104: U2.10 22.41,27.12 arc(22.46,27.11) 22.5,27.09 arc(22.54,27.06) 22.58,27.05 23.2,27.05 v2(23.32,27.17) ; v2(8.58,63.14) 8.46,63.02 arc(8.46,63.02) 8.45,63.02 6.84,63.02 arc(6.76,63.04) 6.69,63.08 arc(6.62,63.13) 6.54,63.14 FPC1.16
  Bottom Layer w0.104: v2(8.58,63.14) arc(8.72,63.05) 8.88,63.02 10.84,63.02 arc(12.63,62.28) 13.38,60.48 13.38,54.67 arc(13.25,54.36) 12.93,54.23 12.9,54.23 arc(12.71,54.04) 12.9,53.85 12.93,53.85 arc(13.38,53.4) 12.93,52.95 12.9,52.95 arc(12.71,52.76) 12.9,52.57 12.93,52.57 arc(13.38,52.12) 12.93,51.68 12.9,51.68 arc(12.71,51.49) 12.9,51.3 12.93,51.3 arc(13.38,50.85) 12.93,50.4 12.9,50.4 arc(12.71,50.21) 12.9,50.02 12.93,50.02 arc(13.25,49.89) 13.38,49.57 13.38,29.33 arc(14.05,27.72) 15.66,27.05 23.03,27.05 arc(23.19,27.08) v2(23.32,27.17)
MIPI1_CN: length 56.1
  Top Layer w0.104: 13.28,67.26 16.3,67.26 arc(17.02,67.4) 17.62,67.81 17.72,67.91 v2(17.9,67.91) ; 13.28,67.26 7.86,67.26 arc(7.77,67.23) 7.73,67.14 7.73,67.08 arc(7.6,66.95) 7.48,67.08 7.48,67.14 arc(7.44,67.23) 7.35,67.26 6.83,67.26 arc(6.76,67.25) 6.69,67.2 arc(6.62,67.16) 6.54,67.14 FPC1.8 ; 13.28,67.26 arc(13.28,67.26) 13.29,67.26 ; v2(19.75,62.66) 19.72,62.63 arc(19.65,62.52) 19.63,62.4 19.63,61.75 arc(19.5,61.11) 19.14,60.57 18.41,59.84 arc(18.09,59.36) 17.98,58.8 17.98,42.26 arc(18.03,42.13) 18.17,42.07 18.38,42.07 arc(18.83,41.63) 18.38,41.18 18.17,41.18 arc(17.98,40.99) 18.17,40.8 18.38,40.8 arc(18.83,40.35) 18.38,39.91 18.17,39.91 arc(17.98,39.71) 18.17,39.52 18.38,39.52 arc(18.83,39.08) 18.38,38.63 18.17,38.63 arc(18.03,38.57) 17.98,38.44 17.98,32.3 arc(18.34,31.41) 19.23,31.05 19.23,31.05 arc(19.28,31.06) 19.32,31.09 arc(19.36,31.11) 19.4,31.12 U2.29
  Bottom Layer w0.104: v2(17.9,67.91) arc(17.74,67.88) 17.6,67.79 arc(17.41,67.5) 17.34,67.17 17.34,66.87 arc(17.41,66.54) 17.6,66.26 19.38,64.48 arc(19.56,64.2) 19.63,63.88 19.63,62.95 arc(19.66,62.79) v2(19.75,62.66)
MIPI1_CP: length 56.1
  Top Layer w0.104: v2(19.25,62.66) 19.28,62.63 arc(19.35,62.52) 19.37,62.4 19.37,61.75 arc(19.27,61.21) 18.96,60.75 18.23,60.02 arc(17.85,59.46) 17.72,58.8 17.72,42.26 arc(17.85,41.95) 18.17,41.82 18.38,41.82 arc(18.57,41.63) 18.38,41.44 18.17,41.44 arc(17.72,40.99) 18.17,40.54 18.38,40.54 arc(18.57,40.35) 18.38,40.16 18.17,40.16 arc(17.72,39.71) 18.17,39.27 18.38,39.27 arc(18.57,39.08) 18.38,38.89 18.17,38.89 arc(17.85,38.76) 17.72,38.44 17.72,32.3 arc(18.16,31.23) 19.23,30.79 19.23,30.79 arc(19.28,30.78) 19.32,30.76 arc(19.36,30.73) 19.4,30.72 U2.27 ; 13.28,67.52 16.3,67.52 arc(16.92,67.64) 17.44,67.99 17.54,68.1 v2(17.54,68.27) ; 13.28,67.52 6.83,67.52 arc(6.76,67.54) 6.69,67.58 arc(6.62,67.63) 6.54,67.64 FPC1.7 ; 13.28,67.52 arc(13.28,67.52) 13.29,67.52
  Bottom Layer w0.104: v2(19.25,62.66) arc(19.34,62.79) 19.37,62.95 19.37,63.88 arc(19.33,64.11) 19.2,64.3 17.41,66.08 arc(17.17,66.45) 17.09,66.87 17.09,67.17 arc(17.17,67.6) 17.42,67.97 arc(17.51,68.11) v2(17.54,68.27)
MIPI1_D0N: length 56.1
  Top Layer w0.104: FPC1.14 6.54,64.14 arc(6.62,64.16) 6.69,64.2 arc(6.76,64.25) 6.83,64.26 7.15,64.26 arc(7.24,64.23) 7.28,64.14 7.28,64.08 arc(7.4,63.95) 7.53,64.08 7.53,64.14 arc(7.66,64.26) 7.78,64.14 7.78,64.08 arc(7.91,63.96) 8.04,64.08 8.04,64.14 arc(8.07,64.23) 8.16,64.26 10.15,64.26 arc(10.29,64.21) 10.34,64.07 10.34,63.99 arc(10.79,63.54) 11.24,63.99 11.24,64.07 arc(11.43,64.26) 11.62,64.07 11.62,63.99 arc(12.06,63.54) 12.51,63.99 12.51,64.07 arc(12.7,64.26) 12.89,64.07 12.89,63.99 arc(13.34,63.54) 13.79,63.99 13.79,64.07 arc(13.98,64.26) 14.17,64.07 14.17,63.99 arc(14.61,63.54) 15.06,63.99 15.06,64.07 arc(15.25,64.26) 15.44,64.07 15.44,63.99 arc(15.89,63.54) 16.34,63.99 16.34,64.07 arc(16.39,64.21) 16.53,64.26 17.09,64.26 arc(22.93,61.85) 25.34,56.01 25.34,34.13 arc(24.68,32.52) 23.06,31.85 22.58,31.85 arc(22.54,31.86) 22.5,31.89 arc(22.46,31.91) 22.41,31.92 U2.34
MIPI1_D0P: length 56.1
  Top Layer w0.104: FPC1.13 6.54,64.64 arc(6.62,64.63) 6.69,64.58 arc(6.76,64.54) 6.83,64.52 10.15,64.52 arc(10.47,64.39) 10.6,64.07 10.6,63.99 arc(10.79,63.8) 10.98,63.99 10.98,64.07 arc(11.43,64.52) 11.87,64.07 11.87,63.99 arc(12.06,63.8) 12.25,63.99 12.25,64.07 arc(12.7,64.52) 13.15,64.07 13.15,63.99 arc(13.34,63.8) 13.53,63.99 13.53,64.07 arc(13.98,64.52) 14.42,64.07 14.42,63.99 arc(14.61,63.8) 14.8,63.99 14.8,64.07 arc(15.25,64.52) 15.7,64.07 15.7,63.99 arc(15.89,63.8) 16.08,63.99 16.08,64.07 arc(16.21,64.39) 16.53,64.52 17.09,64.52 arc(23.11,62.03) 25.6,56.01 25.6,34.13 arc(24.86,32.34) 23.06,31.59 22.58,31.59 arc(22.54,31.58) 22.5,31.56 arc(22.46,31.53) 22.41,31.52 U2.32
MIPI1_D1N: length 56.1
  Top Layer w0.104: U2.28 22.41,30.72 arc(22.46,30.71) 22.5,30.69 arc(22.54,30.66) 22.58,30.65 23.57,30.65 arc(25.63,31.5) 26.49,33.57 26.49,57 arc(23.92,63.2) 17.73,65.76 8.33,65.76 arc(8.24,65.73) 8.21,65.64 8.21,65.58 arc(8.08,65.46) 7.95,65.58 7.95,65.64 arc(7.83,65.76) 7.7,65.64 7.7,65.58 arc(7.57,65.45) 7.45,65.58 7.45,65.64 arc(7.41,65.73) 7.32,65.76 6.84,65.76 arc(6.76,65.75) 6.69,65.7 arc(6.62,65.66) 6.54,65.64 FPC1.11
MIPI1_D1P: length 56.1
  Top Layer w0.104: U2.26 22.41,30.32 arc(22.46,30.33) 22.5,30.36 arc(22.54,30.38) 22.58,30.39 23.57,30.39 arc(25.81,31.32) 26.74,33.57 26.74,57 arc(24.1,63.38) 17.73,66.02 6.84,66.02 arc(6.76,66.04) 6.69,66.08 arc(6.62,66.13) 6.54,66.14 FPC1.10
MIPI1_D2N: length 56.1
  Top Layer w0.104: U2.23 19.4,29.92 arc(19.36,29.91) 19.32,29.89 arc(19.28,29.86) 19.23,29.85 18.74,29.85 arc(17.12,30.52) 16.46,32.13 16.46,44.01 arc(16.32,44.32) 16.01,44.45 15.88,44.45 arc(15.69,44.64) 15.88,44.83 16.01,44.83 arc(16.46,45.28) 16.01,45.73 15.88,45.73 arc(15.69,45.92) 15.88,46.11 16.01,46.11 arc(16.46,46.56) 16.01,47 15.88,47 arc(15.69,47.19) 15.88,47.38 16.01,47.38 arc(16.46,47.83) 16.01,48.28 15.88,48.28 arc(15.69,48.47) 15.88,48.66 16.01,48.66 arc(16.46,49.11) 16.01,49.55 15.88,49.55 arc(15.69,49.74) 15.88,49.93 16.01,49.93 arc(16.32,50.07) 16.46,50.38 16.46,60.24 arc(16.63,61.11) 17.12,61.85 17.83,62.56 arc(17.97,62.65) v2(18.13,62.68) ; v2(8.58,68.64) 8.46,68.76 arc(8.46,68.76) 8.45,68.76 7.59,68.76 arc(7.5,68.73) 7.46,68.64 7.46,68.58 arc(7.33,68.45) 7.21,68.58 7.21,68.64 arc(7.17,68.73) 7.08,68.76 6.84,68.76 arc(6.76,68.75) 6.69,68.7 arc(6.62,68.66) 6.54,68.64 FPC1.5
  Bottom Layer w0.104: v2(18.13,62.68) 18.06,62.68 arc(17.96,62.66) 17.88,62.61 arc(17.8,62.55) 17.7,62.54 16.79,62.54 arc(15.82,62.73) 14.99,63.28 9.96,68.32 arc(9.46,68.65) 8.88,68.76 arc(8.72,68.73) v2(8.58,68.64)
MIPI1_D2P: length 56.1
  Top Layer w0.104: U2.21 19.4,29.52 arc(19.36,29.53) 19.32,29.56 arc(19.28,29.58) 19.23,29.59 18.74,29.59 arc(16.94,30.34) 16.2,32.13 16.2,44.01 arc(16.14,44.14) 16.01,44.2 15.88,44.2 arc(15.43,44.64) 15.88,45.09 16.01,45.09 arc(16.2,45.28) 16.01,45.47 15.88,45.47 arc(15.43,45.92) 15.88,46.37 16.01,46.37 arc(16.2,46.56) 16.01,46.75 15.88,46.75 arc(15.43,47.19) 15.88,47.64 16.01,47.64 arc(16.2,47.83) 16.01,48.02 15.88,48.02 arc(15.43,48.47) 15.88,48.92 16.01,48.92 arc(16.2,49.11) 16.01,49.3 15.88,49.3 arc(15.43,49.74) 15.88,50.19 16.01,50.19 arc(16.14,50.25) 16.2,50.38 16.2,60.24 arc(16.39,61.21) 16.94,62.03 17.65,62.74 arc(17.74,62.88) v2(17.78,63.04) ; FPC1.4 6.54,69.14 arc(6.62,69.13) 6.69,69.08 arc(6.76,69.04) 6.84,69.02 8.45,69.02 arc(8.46,69.02) 8.46,69.02 v2(8.58,69.14)
  Bottom Layer w0.104: v2(17.78,63.04) 17.78,62.92 arc(17.77,62.87) 17.74,62.83 arc(17.7,62.8) 17.65,62.79 16.79,62.79 arc(15.92,62.97) 15.18,63.46 10.14,68.5 arc(9.56,68.88) 8.88,69.02 arc(8.72,69.05) v2(8.58,69.14)
MIPI1_D3N: length 56.1
  Top Layer w0.104: v2(21.02,32.37) 20.9,32.25 20.18,32.25 arc(20.14,32.26) 20.1,32.29 arc(20.06,32.31) 20.01,32.32 U2.35 ; v2(9.98,70.14) 9.95,70.17 arc(9.85,70.24) 9.72,70.26 8.24,70.26 arc(8.15,70.23) 8.11,70.14 8.11,70.08 arc(7.99,69.96) 7.86,70.08 7.86,70.14 arc(7.73,70.26) 7.6,70.14 7.6,70.08 arc(7.48,69.95) 7.35,70.08 7.35,70.14 arc(7.31,70.23) 7.22,70.26 6.83,70.26 arc(6.76,70.25) 6.69,70.2 arc(6.62,70.16) 6.54,70.14 FPC1.2
  Bottom Layer w0.104: v2(9.98,70.14) arc(10.11,70.23) 10.27,70.26 14.17,70.26 arc(20.99,67.44) 23.82,60.61 23.82,34.53 arc(23.15,32.92) 21.54,32.25 21.32,32.25 arc(21.16,32.28) v2(21.02,32.37)
MIPI1_D3P: length 56.1
  Top Layer w0.104: v2(21.02,31.87) 20.9,31.99 20.18,31.99 arc(20.14,31.98) 20.1,31.96 arc(20.06,31.93) 20.01,31.92 U2.33 ; FPC1.1 6.54,70.64 arc(6.62,70.63) 6.69,70.58 arc(6.76,70.54) 6.83,70.52 9.72,70.52 arc(9.85,70.54) 9.95,70.61 v2(9.98,70.64)
  Bottom Layer w0.104: v2(21.02,31.87) arc(21.16,31.96) 21.32,31.99 21.54,31.99 arc(23.33,32.74) 24.08,34.53 24.08,60.61 arc(21.18,67.62) 14.17,70.52 10.27,70.52 arc(10.11,70.55) v2(9.98,70.64)
USR_LED: length 86.6
  Top Layer w0.254: FPC2.8 3.77,31.6 v2(3.75,31.59) ; U9.2 37.16,71.09 v2(36.39,71.85)
  Inner1 w0.254: v2(3.75,31.59) 0.45,34.89 0.45,73.37 1.47,74.39 33.85,74.39 v2(36.39,71.85)
VLED_P+: length 61
  Top Layer w0.305: v2(21.44,35.01) 21.73,34.72 22.26,34.72
  Inner1 w0.508: v2(21.44,35.01) 22.47,36.04 28.89,36.04 31.31,33.62 v2(31.31,26.89)
  Inner2 w0.508: 10.44,1.77 12.92,1.77 15.69,4.54 15.69,14.45 17.85,16.61 23.31,16.61 24.59,17.88 29.79,17.88 31.95,20.03 31.95,26.26 v2(31.31,26.89)
  vias: v1(6.8,7.32) v1(6.8,5.54) v1(6.8,5.03) v1(6.8,4.52) v1(6.83,2.31) v1(6.83,1.8) v1(6.83,1.3) v1(7.31,7.32) v1(7.31,5.54) v1(7.31,5.03) v1(7.31,4.52) v1(7.34,2.31) v1(7.34,1.8) v1(7.34,1.3) v1(7.84,2.31) v1(7.84,1.8) v1(7.84,1.3) v1(9.9,2.31) v1(9.9,1.8) v1(9.9,1.3)
VLED_P-: length 51.1
  Inner2 w0.508: v2(20.36,35.37) v2(20.36,34.88) 20.36,34.67 20.9,34.13 21.79,34.13 24.33,31.59 28.39,31.59 30.04,29.94 30.04,25.46 26.4,21.81 25.22,21.81 22.17,18.76 17.22,18.76 12.52,14.07 12.52,4.31 12.01,3.8 10.44,3.8
  vias: v1(8.55,4.78) v1(8.55,4.27) v1(8.55,3.76) v1(8.55,3.25) v1(9.06,4.78) v1(9.06,4.27) v1(9.06,3.76) v1(9.06,3.25) v1(9.57,4.78) v1(10.08,4.78) v1(10.59,4.78)
XRES: length 30.6
  Top Layer w0.127: v2(8.84,44.67) 8.84,45.17 R2.2 R1.2 ; U2.38 21.55,32.72 21.28,32.99 v2(21.28,33.37)
  Inner1 w0.254: v2(7.52,32.78) 18.61,32.78 19.9,34.06 20.63,34.06 21.31,33.37
  Bottom Layer w0.127: v2(7.52,32.78) 7.52,40.94 8.84,42.26 v2(8.84,44.67)
  Bottom Layer w0.254: v2(7.52,32.78) 7.47,32.78 7.45,32.76
$1N1024: length 2
  Top Layer w1.016: R3.1 12,5.9 L2.2
$1N5793: length 4
  Top Layer w0.254: 15.19,17.56 15.25,17.49 17.47,17.49 17.88,17.9 17.88,18.97
$1N5795: length 1.9
  Top Layer w0.254: C8.2 18.53,11.5 18.53,13.23
$1N5796: length 3.5
  Top Layer w0.254: U3.5 19.18,10.75 C10.1
$1N5798: length 1.9
  Top Layer w0.254: U3.2 17.23,11.6 C8.1
$1N5805: length 7.2
  Top Layer w0.254: R8.2 20.97,15.97 19.83,14.83 U3.6
$1N5806: length 4.4
  Top Layer w0.254: U3.7 20.48,9.04 R9.2
$1N5807: length 5.3
  Top Layer w0.254: CN1.4 26.48,14.55 R8.1 C9.1
$1N5808: length 4
  Top Layer w0.254: C11.2 22.16,7.52 R9.1 24.72,8.86 CN1.3
$1N9328: length 2.5
  Top Layer w0.254: C19.2 31.44,23.56 30.76,22.88 30.76,22.27 U6.12
$1N9337: length 5.7
  Top Layer w0.254: C19.1 32.28,21.54 32.28,19.77 32.04,19.53 30.04,19.53 U6.8
$1N9463: length 1.3
  Top Layer w0.254: U6.10 30.99,20.8 31.44,20.35
$1N16105: length 1.8
  Top Layer w0.254: R12.1 43.78,70.44 42.32,70.44

## Copper pours and planes (outline as drawn; the poured copper is in the pictures)
AGND on Top Layer: 32.71,0 32.71,16.86 14.17,16.86 14.17,15.13 18.6,4.43 29.3,0
AGND on Bottom Layer: 32.71,0 32.71,16.86 14.17,16.86 14.17,15.13 18.6,4.43 29.3,0
AGND on Inner1: 32.71,0 32.71,16.86 14.17,16.86 14.17,15.13 18.6,4.43 29.3,0
AGND on Inner2: 32.71,0 32.71,16.86 14.17,16.86 14.17,15.13 18.6,4.43 29.3,0
GND on Top Layer: 31.56,74.89 53.53,74.89 53.53,67.27 31.56,67.27
GND on Top Layer: 48.98,73.5 49.68,73.5 49.68,68.68 48.98,68.68
GND on Top Layer: 0,74.89 32.71,74.89 32.71,0 0,0
GND on Top Layer: 12.99,5.09 12.99,1.06 11.13,1.06 11.13,5.09
GND on Top Layer: 5.02,56.3 6.52,56.3 6.52,53.99 5.02,53.99
GND on Bottom Layer: 0,74.89 32.71,74.89 32.71,0 0,0
GND on Bottom Layer: 31.56,74.89 53.53,74.89 53.53,67.27 31.56,67.27
GND on Inner1: 0,74.89 32.71,74.89 32.71,0 0,0
GND on Inner2: 0,74.89 32.71,74.89 32.71,0 0,0
V1.1 on Top Layer: 4.97,43.32 7.5,43.32 7.5,41.95 4.97,41.95
V1.1 on Inner2: 6.69,43.32 7.5,43.32 7.5,41.96 6.69,41.96
V1.8_P on Top Layer: 4.97,44.81 7.5,44.81 7.5,43.47 4.97,43.47
V1.8_P on Inner2: 6.69,44.82 7.5,44.82 7.5,43.46 6.69,43.46
V3.3 on Top Layer: 4.97,46.32 7.5,46.32 7.5,44.96 4.97,44.96
V3.3 on Inner2: 6.69,46.32 7.5,46.32 7.5,44.96 6.69,44.96
V5 on Top Layer: 4.96,53.85 7.5,53.85 7.5,51.96 4.96,51.96
V5 on Top Layer: 50.28,73.5 50.98,73.5 50.98,68.68 50.28,68.68
V5 on Top Layer: 1.06,8.66 1.06,5.11 6.47,5.11 6.47,7.74 8.49,7.74 8.49,8.66
V5 on Bottom Layer: 5.85,8.48 5.85,5.1 0.59,5.1 0.59,8.48
V5 on Inner2: 5.77,8.68 5.77,5.09 1.05,5.09 1.05,8.68
V5 on Inner2: 6.61,53.85 7.5,53.85 7.5,51.96 6.61,51.96
(no net) on Top Layer: 47.68,73.5 48.38,73.5 48.38,68.68 47.68,68.68
(no net) on Top Layer: 51.58,73.5 52.28,73.5 52.28,68.67 51.58,68.67
LX_LED_P on Top Layer: 6.52,2.52 6.52,1.09 1.83,1.09 1.83,2.52
VLED_P+ on Top Layer: 7.57,7.62 7.57,4.33 6.6,4.33 6.6,7.62
VLED_P+ on Top Layer: 10.97,2.59 10.97,1.06 6.64,1.06 6.64,2.59
VLED_P+ on Bottom Layer: 10.1,2.51 10.1,1.11 6.63,1.11 6.63,2.51
VLED_P+ on Bottom Layer: 7.9,7.75 7.9,4.14 6.57,4.14 6.57,7.75
VLED_P+ on Inner2: 5.89,7.62 5.89,0.79 11.05,0.79 11.05,2.59 8.19,2.59 8.19,7.62
VLED_P- on Top Layer: 19.46,35.61 20.59,35.61 20.59,34.62 19.46,34.62
VLED_P- on Top Layer: 10.97,5.08 10.97,2.73 7.7,2.73 7.7,5.08
VLED_P- on Bottom Layer: 10.95,5.2 10.95,2.64 8.04,2.64 8.04,5.2
VLED_P- on Inner2: 11.06,5.38 11.06,2.73 8.33,2.73 8.33,5.38
$1N1024 on Top Layer: 13,6.64 13,5.21 9.21,5.21 9.21,6.64
GND_P on Top Layer: 0.2,55.97 0.2,74.64 10.74,74.64 23.22,69.47 28.39,56.99 28.39,28.54 26.79,24.68 22.93,23.08 12.01,23.08 9.05,24.31 7.82,27.27 7.82,39.58 7.98,40.41 9.21,42.24 9.47,43.57 9.47,54.06 8.91,55.41 7.55,55.98 0.2,55.98
GND_P on Bottom Layer: 0.2,55.97 0.2,74.64 10.74,74.64 23.22,69.47 28.39,56.99 28.39,28.54 26.79,24.68 22.93,23.08 12.01,23.08 9.05,24.31 7.82,27.27 7.82,39.58 7.98,40.41 9.21,42.24 9.47,43.57 9.47,54.06 8.91,55.41 7.55,55.98 0.2,55.98
GND_P on Inner1: 0.2,55.97 0.2,74.64 10.74,74.64 23.22,69.47 28.39,56.99 28.39,28.54 26.79,24.68 22.93,23.08 12.01,23.08 9.05,24.31 7.82,27.27 7.82,39.58 7.98,40.41 9.21,42.24 9.47,43.57 9.47,54.06 8.91,55.41 7.55,55.98 0.2,55.98
GND_P on Inner2: 0.2,55.97 0.2,74.64 10.74,74.64 23.22,69.47 28.39,56.99 28.39,28.54 26.79,24.68 22.93,23.08 12.01,23.08 9.05,24.31 7.82,27.27 7.82,39.58 7.98,40.41 9.21,42.24 9.47,43.57 9.47,54.06 8.91,55.41 7.55,55.98 0.2,55.98

Small or netless copper shapes (teardrops, artwork), in the pictures only: 197 on Top Layer, 20 on Bottom Layer, 14 on Inner1

## Text on the board
Top Silkscreen Layer: JLCJLCJLCJLC
